# Altium schematic sheet IC502.schdoc
size 90 x 81 mm
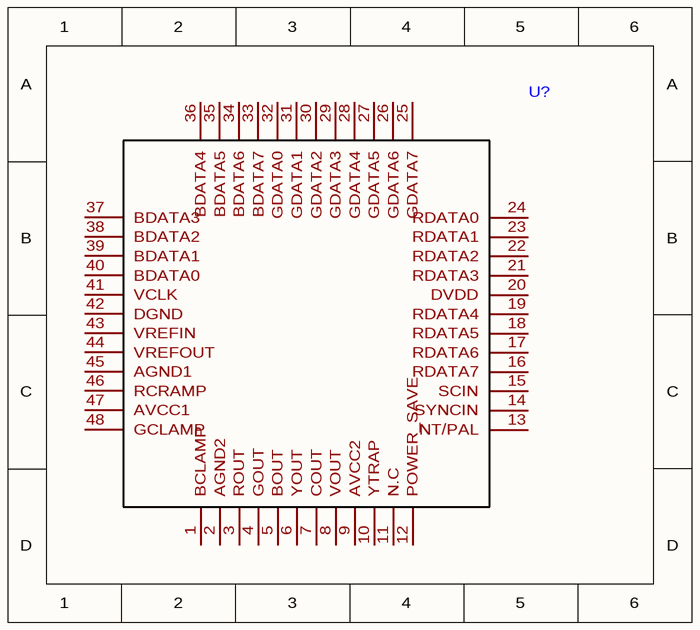
[diagram p0: IC502.schdoc]

## Parts
U?  (no value)  [QFP-48_L7.0-W7.0-P0.50-LS9.0-BL]

## Nets

Not connected (* = marked no-connect by the designer): U? 1(BCLAMP) 2(AGND2) 3(ROUT) 4(GOUT) 5(BOUT) 6(YOUT) 7(COUT) 8(VOUT) 9(AVCC2) 10(YTRAP) 11(N.C) 12(POWER_SAVE) 13(NT/PAL) 14(SYNCIN) 15(SCIN) 16(RDATA7) 17(RDATA6) 18(RDATA5) 19(RDATA4) 20(DVDD) 21(RDATA3) 22(RDATA2) 23(RDATA1) 24(RDATA0) 25(GDATA7) 26(GDATA6) 27(GDATA5) 28(GDATA4) 29(GDATA3) 30(GDATA2) 31(GDATA1) 32(GDATA0) 33(BDATA7) 34(BDATA6) 35(BDATA5) 36(BDATA4) 37(BDATA3) 38(BDATA2) 39(BDATA1) 40(BDATA0) 41(VCLK) 42(DGND) 43(VREFIN) 44(VREFOUT) 45(AGND1) 46(RCRAMP) 47(AVCC1) 48(GCLAMP)

## Library data of the parts
U? = IC502